# Altium schematic sheet Power.SchDoc
size A; SheetNumber: 2
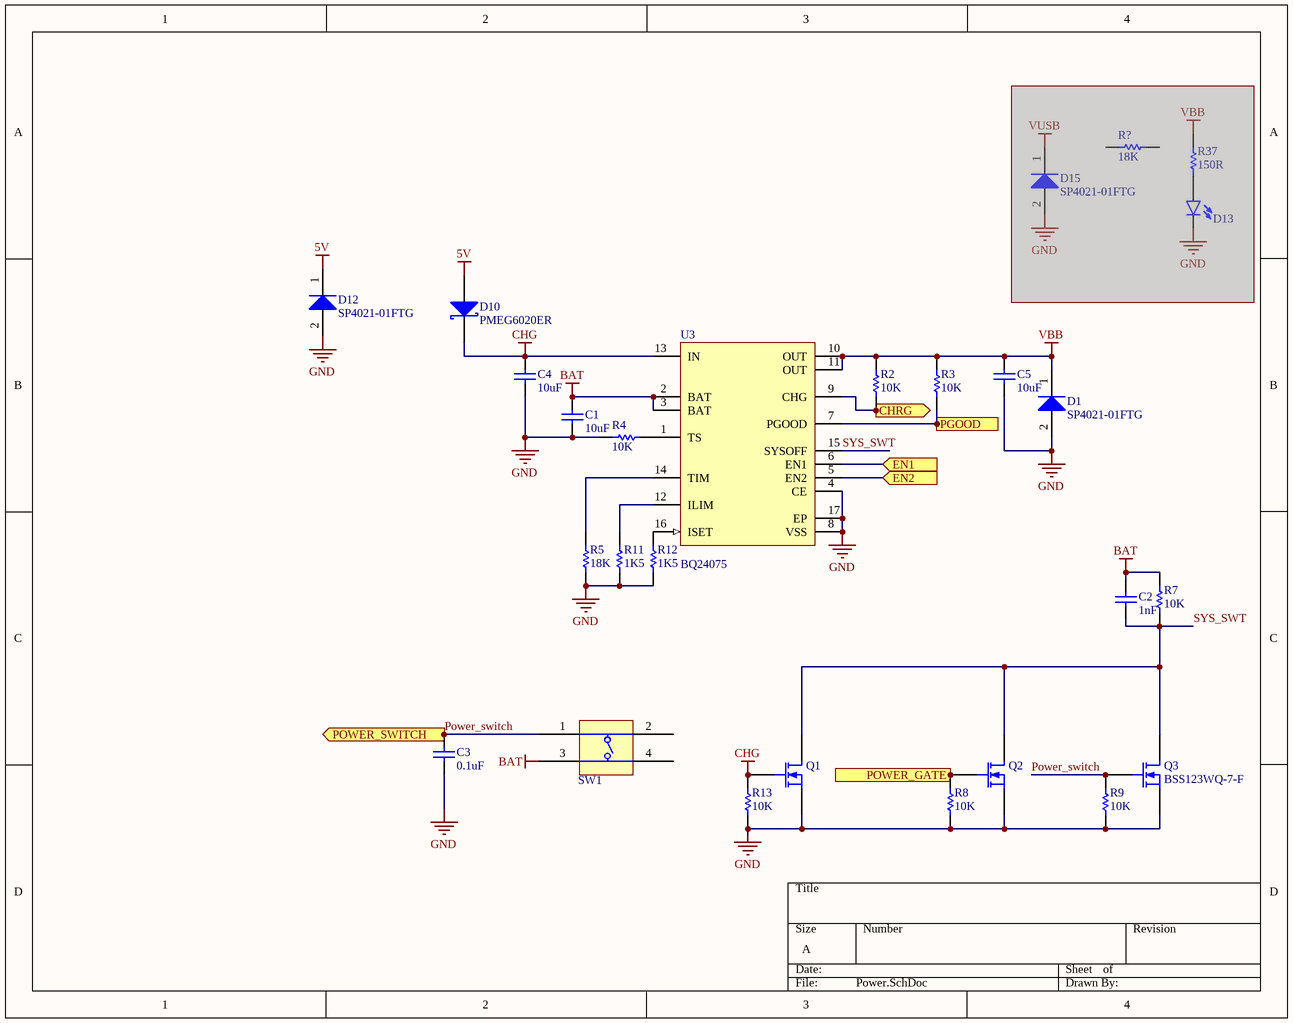
[diagram p0: Power.SchDoc]

## Parts
C1  value 10uF  [C1206[3216X160]]  (hidden comment: 10uF 50V 1206)
C2  value 1nF  [C0603[1608X92]]  (hidden comment: 1nF 50V 0603)
C3  value 0.1uF  [C0603[1608X92]]  (hidden comment: 0.1uF 6.3V 0603)
C4  value 10uF  [C1206[3216X160]]  (hidden comment: 10uF 50V 1206)
C5  value 10uF  [C1206[3216X160]]  (hidden comment: 10uF 50V 1206)
D1  SP4021-01FTG  [SOD-323]
D10  PMEG6020ER  [SOD-123]
D12  SP4021-01FTG  [SOD-323]
D13  LED_0603_GREEN_5mA  [LED0603]  (value not drawn)  (masked out: inside a compile mask, not in the netlist)
D15  SP4021-01FTG  [SOD-323]  (masked out: inside a compile mask, not in the netlist)
Q1  BSS123WQ-7-F  [SOT323-3]  (value not drawn)
Q2  BSS123WQ-7-F  [SOT323-3]  (value not drawn)
Q3  BSS123WQ-7-F  [SOT323-3]
R2  value 10K  [R0603[1608]]  (hidden comment: 10K 1% 0603)
R3  value 10K  [R0603[1608]]  (hidden comment: 10K 1% 0603)
R4  value 10K  [R0603[1608]]  (hidden comment: 10K 1% 0603)
R5  value 18K  [R0603[1608]]  (hidden comment: 18K 1% 0603)
R7  value 10K  [R0603[1608]]  (hidden comment: 10K 1% 0603)
R8  value 10K  [R0603[1608]]  (hidden comment: 10K 1% 0603)
R9  value 10K  [R0603[1608]]  (hidden comment: 10K 1% 0603)
R11  value 1K5  [R0603[1608]]  (hidden comment: 1K5 1% 0603)
R12  value 1K5  [R0603[1608]]  (hidden comment: 1K5 1% 0603)
R13  value 10K  [R0603[1608]]  (hidden comment: 10K 1% 0603)
R37  value 150R  [R0603[1608]]  (hidden comment: 150R 1% 0603)  (masked out: inside a compile mask, not in the netlist)
R?  value 18K  [R0603[1608]]  (hidden comment: 18K 1% 0603)  (masked out: inside a compile mask, not in the netlist)
SW1  DIPT-DTSM-6  [PTS810]  (value not drawn)
U3  BQ24075  [QFN-16]

## Ports
CHRG (out), EN1 (in), EN2 (in), PGOOD (out), POWER_GATE (in), POWER_SWITCH (out)

## Nets
5V: D10.2(A) D12.1(K)
BAT: C1.2 C2.2 R7.2 SW1.3 U3.2(BAT) U3.3(BAT)
CHG: C4.2 D10.1(K) Q1.1(G) R13.2 U3.13(IN)
GND: C1.1 C3.1 C4.1 C5.1 D1.2(A) D12.2(A) Q1.2(S) Q2.2(S) Q3.2(S) R4.2 R5.1 R8.1 R9.1 R11.1 R12.1 R13.1 U3.4(CE) U3.8(VSS) U3.17(EP)
VBB: C5.2 D1.1(K) R2.2 R3.2 U3.10(OUT) U3.11(OUT)
CHRG: R2.1 U3.9(CHG) ; port CHRG
EN1: U3.6(EN1) ; port EN1
EN2: U3.5(EN2) ; port EN2
PGOOD: R3.1 U3.7(PGOOD) ; port PGOOD
POWER_GATE: Q2.1(G) R8.2 ; port POWER_GATE
Power_switch: C3.2 Q3.1(G) R9.2 SW1.1 ; port POWER_SWITCH
SYS_SWT: C2.1 Q1.3(D) Q2.3(D) Q3.3(D) R7.1 U3.15(SYSOFF)
NetR4_1: R4.1 U3.1(TS)
NetR5_2: R5.2 U3.14(TIM)
NetR11_2: R11.2 U3.12(ILIM)
NetR12_2: R12.2 U3.16(ISET)

Not connected (* = marked no-connect by the designer): SW1 2 4

## Library data of the parts
C1 C4 C5 = CAP_10uF_50V_1206_20%: 10uF 50V 20% 1206 (3216 Metric); PartNumber: UMK316BBJ106ML-T; Manufacturer: Taiyo Yuden; Mounting Technology: Surface Mount; PackageReference: 1206; PackageDescription: 1206 (3216 Metric); Voltage: 50V; Tolerance: 20%
C2 = CAP_1nF_50V_0603_5%: 1nF 50V 5% 0603 (1608 Metric); PartNumber: GRM1885C1H102JA01D; Manufacturer: Murata; TemperatureCoefficient: C0G; Mounting Technology: Surface Mount; PackageReference: 0603; PackageDescription: 0603 (1608 Metric); Voltage: 50V; Tolerance: 5%
C3 = CAP_0.1uF_6.3V_0603_10%: 0.1uF 6.3V 10% 0603 (1608 Metric); PartNumber: GRM188R70J104KA01D; Manufacturer: Murata; Mounting Technology: Surface Mount; PackageReference: 0603; PackageDescription: 0603 (1608 Metric); Voltage: 6.3V; Tolerance: 10%
D1 D12 D15 = SP4021-01FTG: Manufacturer: Littelfuse; PartNumber: SP4021-01FTG; PackageReference: SOD-323-2; Mounting Technology: Surface Mount
D10 = PMEG6020ER: PartNumber: PMEG6020ER,115; Manufacturer: NXP Semiconductors; PackageReference: SOD-123W; PackageDescription: SOD, 2-Leads, Body 2.69x1.6mm; Mounting Technology: Surface Mount
D13 = LED_0603_GREEN_5mA: PartNumber: LTST-C193TGKT-5A; Manufacturer: Lite-On Inc.; PackageReference: 0603; PackageDescription: 0603 (1608 Metric); Mounting Technology: Surface Mount
Q1-Q3 = BSS123WQ-7-F: N-Channel MOSFET; Manufacturer: Diodes Incorporated; PackageReference: SOT-323-3; PartNumber: BSS123WQ-7-F; Mounting Technology: Surface Mount
R2-R4 R7-R9 R13 = RES_10K_0603_1%: 10K 0.25W 1% 0603 (1005 Metric); Manufacturer: Vishay / Dale; PartNumber: CRCW060310K0FKEAHP; Tolerance: 1%; Power: 0.25W; Mounting Technology: Surface Mount; PackageReference: 0603; PackageDescription: 0603 (1608 Metric); ComponentLink1Description: Datasheet; ComponentLink1URL: http://www.vishay.com/docs/20065/rcse3.pdf
R5 R? = RES_18K_0603_1%: 18K 0.25W 1% 0603 (1005 Metric); Manufacturer: Vishay / Dale; PartNumber: CRCW060318K0FKEAHP; Tolerance: 1%; Power: 0.25W; Mounting Technology: Surface Mount; PackageReference: 0603; PackageDescription: 0603 (1608 Metric); ComponentLink1Description: Datasheet; ComponentLink1URL: http://www.vishay.com/docs/20043/crcwhpe3.pdf
R11 R12 = RES_1K5_0603_1%: 1K5 0.25W 1% 0603 (1005 Metric); Manufacturer: Vishay / Dale; PartNumber: CRCW06031K50FKEAHP; Tolerance: 1%; Power: 0.25W; Mounting Technology: Surface Mount; PackageReference: 0603; PackageDescription: 0603 (1608 Metric); ComponentLink1Description: Datasheet; ComponentLink1URL: http://www.vishay.com/docs/20043/crcwhpe3.pdf
R37 = RES_150R_0603_1%: 150R 0.25W 1% 0603 (1005 Metric); Manufacturer: Vishay / Dale; PartNumber: CRCW0603150RFKEAHP; Tolerance: 1%; Power: 0.25W; Mounting Technology: Surface Mount; PackageReference: 0603; PackageDescription: 0603 (1608 Metric); ComponentLink1Description: Datasheet; ComponentLink1URL: http://www.vishay.com/docs/20043/crcwhpe3.pdf
SW1 = DIPT-DTSM-6: Switch, SPNO Push Button SMD; Manufacturer: C&K Components; PartNumber: PTS810 SJM 250 SMTR LFS; PackageReference: PTS810
U3 = BQ24075: Standalone 1-Cell 1.5-A Linear Battery Charger with Power Path; Manufacturer: Texas Instruments; PartNumber: BQ24075; PackageReference: VQFN-16; Mounting Technology: Surface Mount